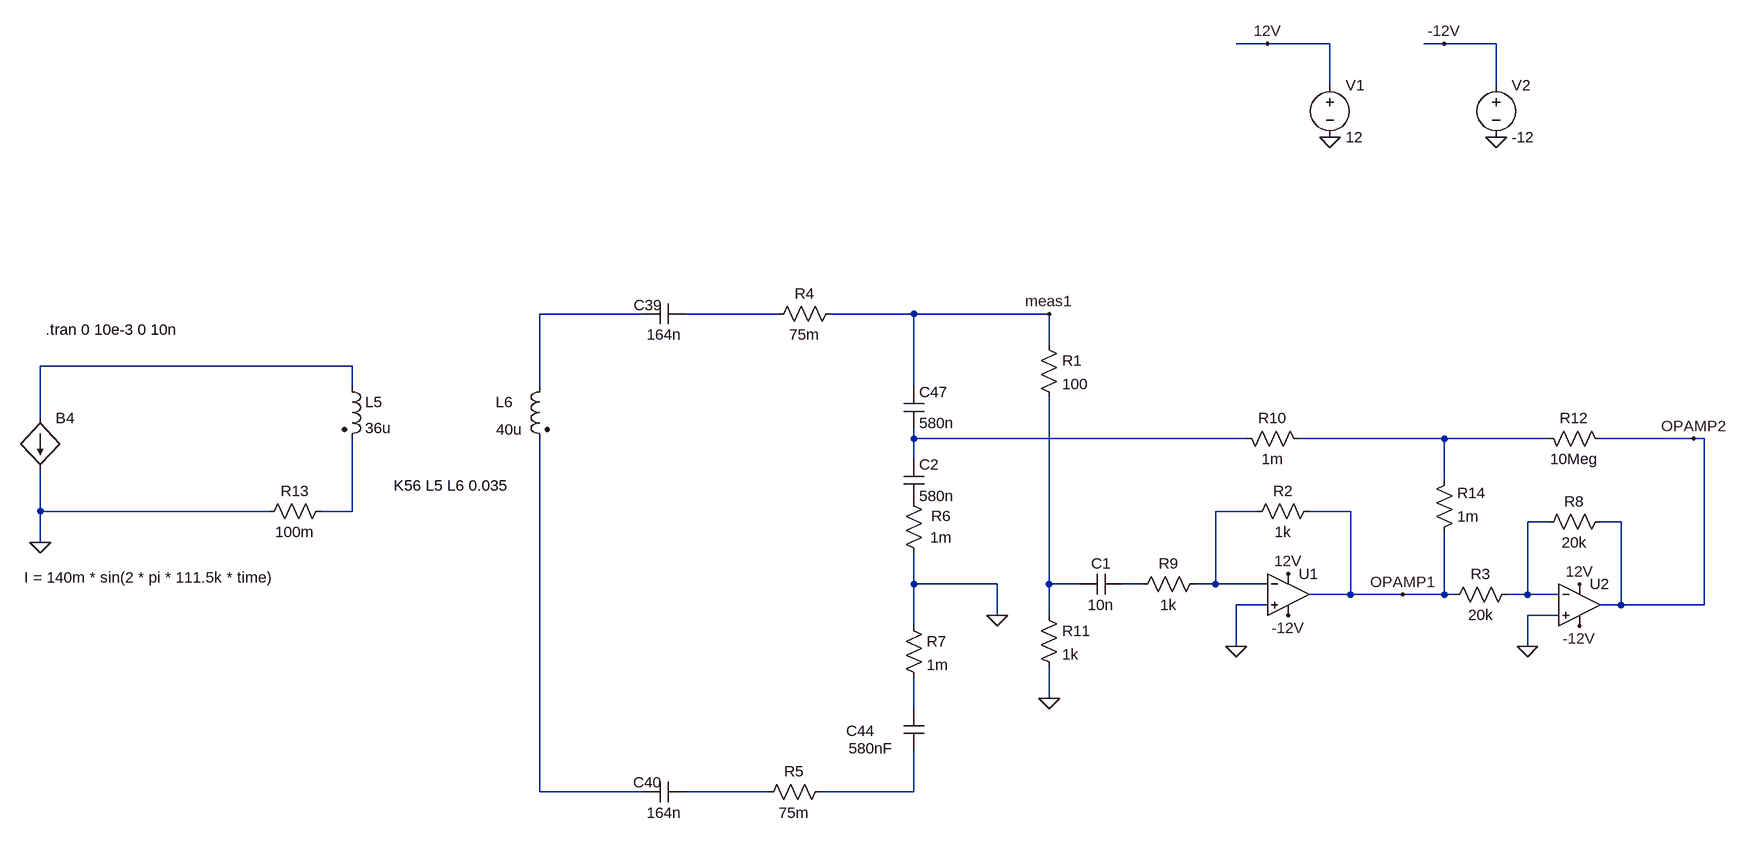
[diagram p0: schematic IMN_DIPS_CANCELATION_simplified.asc]
IMN_DIPS_CANCELATION_simplified.asc, the LTspice schematic file:
Version 4
SHEET 1 9932 3220
WIRE 3552 496 3504 496
WIRE 3648 496 3552 496
WIRE 3824 496 3792 496
WIRE 3904 496 3824 496
WIRE 3648 560 3648 496
WIRE 3904 560 3904 496
WIRE 2592 912 2432 912
WIRE 2800 912 2656 912
WIRE 3008 912 2880 912
WIRE 3216 912 3008 912
WIRE 3216 960 3216 912
WIRE 2144 992 1664 992
WIRE 2144 1024 2144 992
WIRE 2432 1024 2432 912
WIRE 3008 1024 3008 912
WIRE 1664 1072 1664 992
WIRE 3008 1104 3008 1088
WIRE 3520 1104 3008 1104
WIRE 3824 1104 3600 1104
WIRE 3984 1104 3824 1104
WIRE 4208 1104 4064 1104
WIRE 4224 1104 4208 1104
WIRE 3008 1136 3008 1104
WIRE 3824 1168 3824 1104
WIRE 1664 1216 1664 1152
WIRE 2016 1216 1664 1216
WIRE 2144 1216 2144 1104
WIRE 2144 1216 2096 1216
WIRE 3536 1216 3472 1216
WIRE 3680 1216 3616 1216
WIRE 3984 1232 3952 1232
WIRE 4096 1232 4064 1232
WIRE 1664 1264 1664 1216
WIRE 3008 1328 3008 1280
WIRE 3136 1328 3008 1328
WIRE 3216 1328 3216 1040
WIRE 3264 1328 3216 1328
WIRE 3360 1328 3328 1328
WIRE 3472 1328 3472 1216
WIRE 3472 1328 3440 1328
WIRE 3552 1328 3472 1328
WIRE 3680 1344 3680 1216
WIRE 3680 1344 3616 1344
WIRE 3760 1344 3680 1344
WIRE 3824 1344 3824 1248
WIRE 3824 1344 3760 1344
WIRE 3840 1344 3824 1344
WIRE 3952 1344 3952 1232
WIRE 3952 1344 3920 1344
WIRE 4000 1344 3952 1344
WIRE 3552 1360 3504 1360
WIRE 4096 1360 4096 1232
WIRE 4096 1360 4064 1360
WIRE 4224 1360 4224 1104
WIRE 4224 1360 4096 1360
WIRE 3136 1376 3136 1328
WIRE 3216 1376 3216 1328
WIRE 4000 1376 3952 1376
WIRE 3008 1392 3008 1328
WIRE 3504 1424 3504 1360
WIRE 3952 1424 3952 1376
WIRE 3216 1504 3216 1456
WIRE 3008 1520 3008 1472
WIRE 2432 1648 2432 1104
WIRE 2592 1648 2432 1648
WIRE 2784 1648 2656 1648
WIRE 3008 1648 3008 1584
WIRE 3008 1648 2864 1648
FLAG 1664 1264 0
FLAG 3504 1424 0
FLAG 3584 1312 12V
FLAG 3584 1376 -12V
FLAG 3648 640 0
FLAG 3904 640 0
FLAG 3552 496 12V
FLAG 3824 496 -12V
FLAG 3136 1376 0
FLAG 3952 1424 0
FLAG 4032 1392 -12V
FLAG 4032 1328 12V
FLAG 3216 1504 0
FLAG 3216 912 meas1
FLAG 3760 1344 OPAMP1
FLAG 4208 1104 OPAMP2
SYMBOL ind2 2128 1008 R0
SYMATTR InstName L5
SYMATTR Value 36u
SYMATTR Type ind
SYMATTR SpiceLine Rpar=1MEG
SYMBOL res 2112 1200 R90
WINDOW 0 0 56 VBottom 2
WINDOW 3 32 56 VTop 2
SYMATTR InstName R13
SYMATTR Value 100m
SYMBOL ind2 2448 1008 M0
WINDOW 3 42 82 Left 2
WINDOW 0 56 40 Left 2
SYMATTR Value 40u
SYMATTR InstName L6
SYMATTR Type ind
SYMATTR SpiceLine Rpar=1MEG
SYMBOL cap 2592 928 R270
WINDOW 0 14 7 VTop 2
WINDOW 3 0 32 VBottom 2
SYMATTR InstName C39
SYMATTR Value 164n
SYMATTR SpiceLine Rser=3m
SYMBOL cap 2592 1664 R270
WINDOW 0 15 6 VTop 2
WINDOW 3 0 32 VBottom 2
SYMATTR InstName C40
SYMATTR Value 164n
SYMATTR SpiceLine Rser=3m
SYMBOL cap 3024 1584 R180
WINDOW 0 76 30 Left 2
WINDOW 3 47 3 Left 2
SYMATTR InstName C44
SYMATTR Value 580nF
SYMATTR SpiceLine Rser=3m
SYMBOL cap 2992 1024 R0
SYMATTR InstName C47
SYMATTR Value 580n
SYMATTR SpiceLine Rser=3m
SYMBOL bi 1664 1072 R0
WINDOW 3 -25 246 Left 2
SYMATTR Value I = 140m * sin(2 * pi * 111.5k * time)
SYMATTR InstName B4
SYMBOL OpAmps\\UniversalOpAmp 3584 1344 R0
SYMATTR InstName U1
SYMBOL res 3632 1200 R90
WINDOW 0 0 56 VBottom 2
WINDOW 3 32 56 VTop 2
SYMATTR InstName R2
SYMATTR Value 1k
SYMBOL voltage 3648 544 R0
SYMATTR InstName V1
SYMATTR Value 12
SYMBOL voltage 3904 544 R0
SYMATTR InstName V2
SYMATTR Value -12
SYMBOL res 2896 896 R90
WINDOW 0 0 56 VBottom 2
WINDOW 3 32 56 VTop 2
SYMATTR InstName R4
SYMATTR Value 75m
SYMBOL res 2880 1632 R90
WINDOW 0 0 56 VBottom 2
WINDOW 3 32 56 VTop 2
SYMATTR InstName R5
SYMATTR Value 75m
SYMBOL res 2992 1184 R0
WINDOW 0 43 39 Left 2
WINDOW 3 41 72 Left 2
SYMATTR InstName R6
SYMATTR Value 1m
SYMBOL res 2992 1376 R0
SYMATTR InstName R7
SYMATTR Value 1m
SYMBOL cap 2992 1136 R0
SYMATTR InstName C2
SYMATTR Value 580n
SYMATTR SpiceLine Rser=3m
SYMBOL OpAmps\\UniversalOpAmp 4032 1360 R0
SYMATTR InstName U2
SYMBOL res 3936 1328 R90
WINDOW 0 0 56 VBottom 2
WINDOW 3 32 56 VTop 2
SYMATTR InstName R3
SYMATTR Value 20k
SYMBOL res 4080 1216 R90
WINDOW 0 0 56 VBottom 2
WINDOW 3 32 56 VTop 2
SYMATTR InstName R8
SYMATTR Value 20k
SYMBOL res 3456 1312 R90
WINDOW 0 0 56 VBottom 2
WINDOW 3 32 56 VTop 2
SYMATTR InstName R9
SYMATTR Value 1k
SYMBOL res 3616 1120 M270
WINDOW 0 32 56 VTop 2
WINDOW 3 0 56 VBottom 2
SYMATTR InstName R10
SYMATTR Value 1m
SYMBOL res 3200 944 R0
SYMATTR InstName R1
SYMATTR Value 100
SYMBOL res 3200 1360 R0
SYMATTR InstName R11
SYMATTR Value 1k
SYMBOL res 4080 1120 M270
WINDOW 0 32 56 VTop 2
WINDOW 3 0 56 VBottom 2
SYMATTR InstName R12
SYMATTR Value 10Meg
SYMBOL res 3808 1264 M180
WINDOW 0 36 76 Left 2
WINDOW 3 36 40 Left 2
SYMATTR InstName R14
SYMATTR Value 1m
SYMBOL cap 3328 1312 R90
WINDOW 0 0 32 VBottom 2
WINDOW 3 32 32 VTop 2
SYMATTR InstName C1
SYMATTR Value 10n
TEXT 2208 1176 Left 2 !K56 L5 L6 0.035
TEXT 1672 936 Left 2 !.tran 0 10e-3 0 10n

The netlist it stands for:
* IMN_DIPS_CANCELATION_simplified.asc
L5 N003 N006 36u Rpar=1MEG
R13 N006 0 100m
L6 N001 N012 40u Rpar=1MEG
C39 N001 N002 164n Rser=3m
C40 N012 N013 164n Rser=3m
C44 N014 N011 580nF Rser=3m
C47 meas1 N004 580n Rser=3m
B4 N003 0 I = 140m * sin(2 * pi * 111.5k * time)
XU1 0 N007 12V -12V OPAMP1 level1 Avol=1Meg GBW=10Meg Vos=0 En=0 Enk=0 In=0 Ink=0 Rin=500Meg  ; pins In+ In- V+ V- OUT
R2 OPAMP1 N007 1k
V1 12V 0 12
V2 -12V 0 -12
R4 meas1 N002 75m
R5 N014 N013 75m
R6 P001 0 1m
R7 0 N011 1m
C2 N004 P001 580n Rser=3m
XU2 0 N008 12V -12V OPAMP2 level1 Avol=1Meg GBW=10Meg Vos=0 En=0 Enk=0 In=0 Ink=0 Rin=500Meg  ; pins In+ In- V+ V- OUT
R3 N008 OPAMP1 20k
R8 OPAMP2 N008 20k
R9 N007 N010 1k
R10 N005 N004 1m
R1 meas1 N009 100
R11 N009 0 1k
R12 OPAMP2 N005 10Meg
R14 OPAMP1 N005 1m
C1 N010 N009 10n
K56 L5 L6 0.035
.tran 0 10e-3 0 10n
.lib UniversalOpAmp1.lib
.backanno
.end